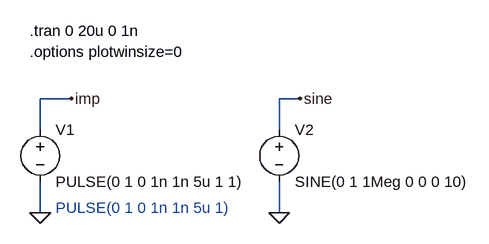
[diagram p0: schematic impulse_sine_burst.asc]
impulse_sine_burst.asc, the LTspice schematic file:
Version 4
SHEET 1 880 680
WIRE 112 32 64 32
WIRE 464 32 432 32
WIRE 64 80 64 32
WIRE 432 80 432 32
WIRE 64 208 64 160
WIRE 432 208 432 160
FLAG 64 208 0
FLAG 432 208 0
FLAG 112 32 imp
FLAG 464 32 sine
SYMBOL voltage 64 64 R0
WINDOW 123 0 0 Left 0
WINDOW 39 0 0 Left 0
SYMATTR InstName V1
SYMATTR Value PULSE(0 1 0 1n 1n 5u 1 1)
SYMBOL voltage 432 64 R0
WINDOW 123 0 0 Left 0
WINDOW 39 0 0 Left 0
SYMATTR InstName V2
SYMATTR Value SINE(0 1 1Meg 0 0 0 10)
TEXT 48 -72 Left 0 !.tran 0 20u 0 1n
TEXT 48 -40 Left 0 !.options plotwinsize=0
TEXT 88 200 Left 0 ;PULSE(0 1 0 1n 1n 5u 1)

The netlist it stands for:
* impulse_sine_burst.asc
V1 imp 0 PULSE(0 1 0 1n 1n 5u 1 1)
V2 sine 0 SINE(0 1 1Meg 0 0 0 10)
.tran 0 20u 0 1n
.options plotwinsize=0
* PULSE(0 1 0 1n 1n 5u 1)
.backanno
.end